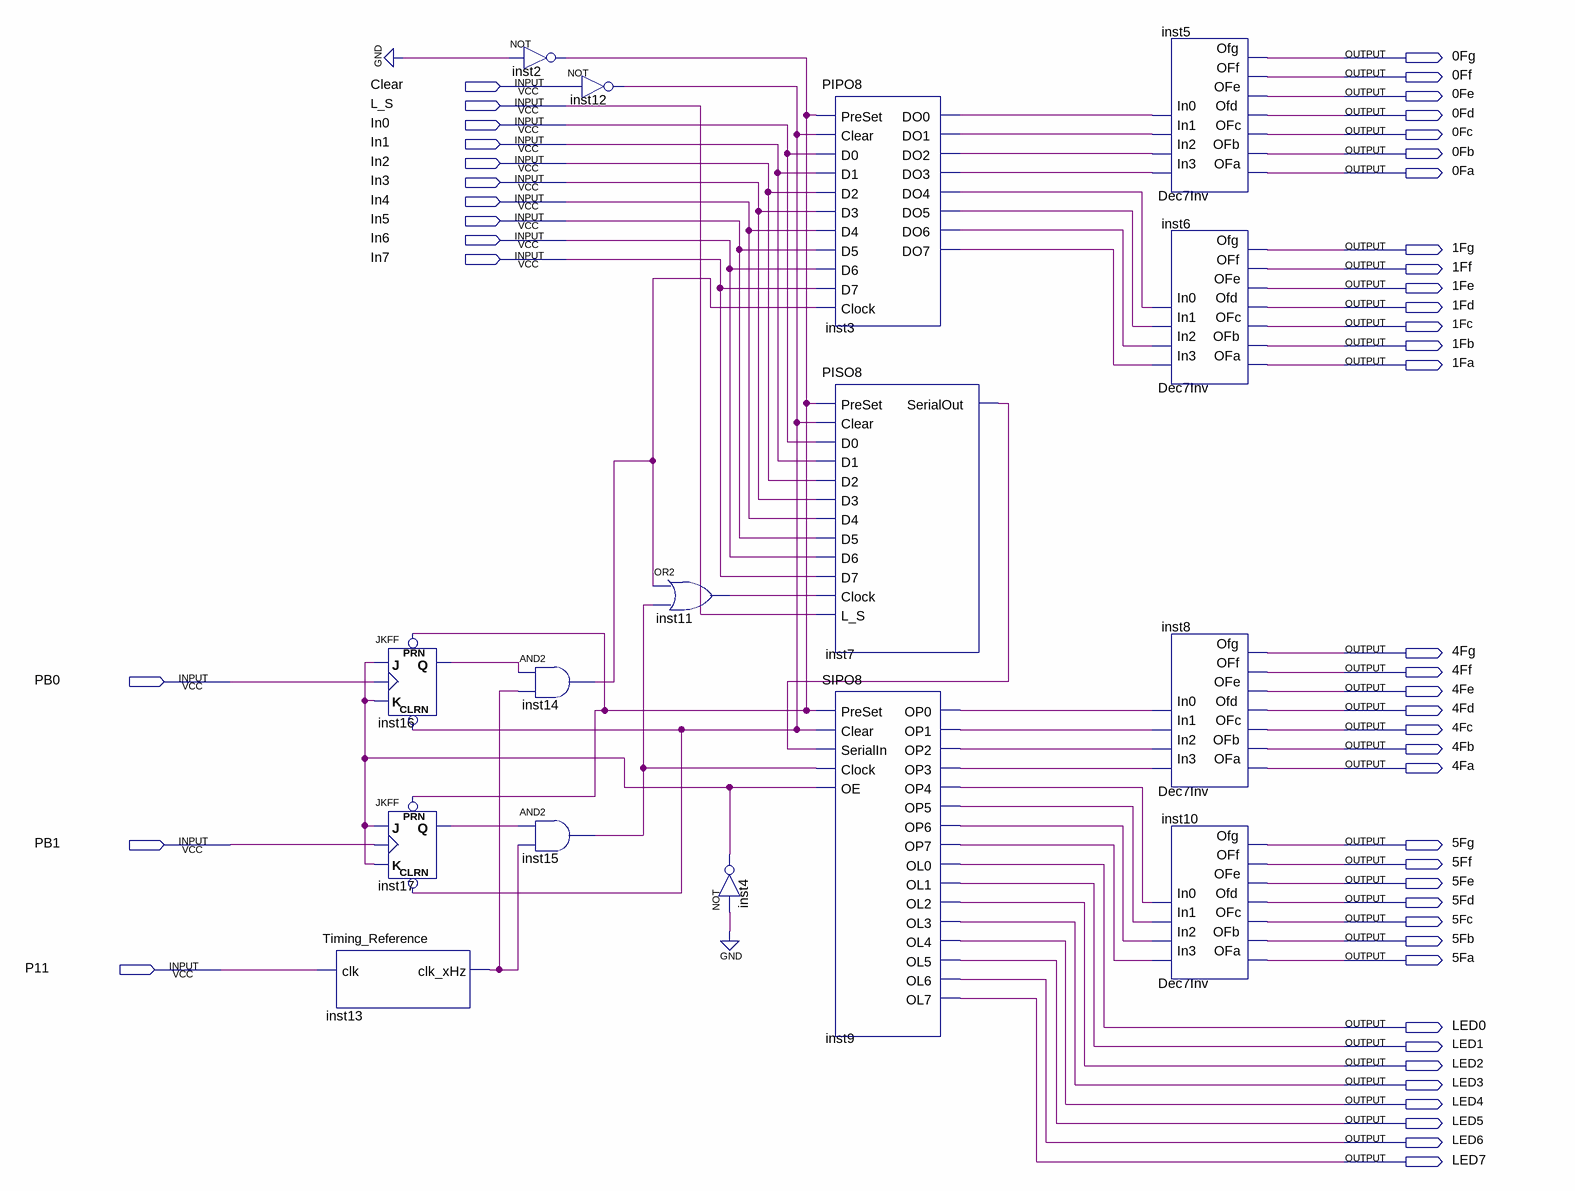
[diagram p0: schematic sheet]
// Quartus schematic Lab3.bdf as structural Verilog: 16 symbols, 49 pins
module Lab3 (
  input  Clear,
  input  L_S,
  input  In0,
  input  In1,
  input  In2,
  input  In3,
  input  In4,
  input  In5,
  input  In6,
  input  In7,
  input  PB0,
  input  PB1,
  input  P11,
  output \0Fg ,
  output \0Ff ,
  output \0Fe ,
  output \0Fd ,
  output \0Fc ,
  output \0Fb ,
  output \0Fa ,
  output \1Fg ,
  output \1Ff ,
  output \1Fe ,
  output \1Fd ,
  output \1Fc ,
  output \1Fb ,
  output \1Fa ,
  output \4Fg ,
  output \4Ff ,
  output \4Fe ,
  output \4Fd ,
  output \4Fc ,
  output \4Fb ,
  output \4Fa ,
  output \5Fg ,
  output \5Ff ,
  output \5Fe ,
  output \5Fd ,
  output \5Fc ,
  output \5Fb ,
  output \5Fa ,
  output LED0,
  output LED1,
  output LED2,
  output LED3,
  output LED4,
  output LED5,
  output LED6,
  output LED7
);

  wire inst2_out, inst3_do0, inst3_do1, inst3_do2, inst3_do3, inst3_do4, inst3_do5, inst3_do6, inst3_do7,
       inst4_out, inst7_serialout, inst9_op0, inst9_op1, inst9_op2, inst9_op3, inst9_op4, inst9_op5,
       inst9_op6, inst9_op7, inst11_out, inst12_out, inst13_clk_xhz, inst14_out, inst15_out, inst16_q,
       inst17_q;

  Timing_Reference inst13 (.clk(P11), .clk_xHz(inst13_clk_xhz));
  JKFF inst16 (.PRN(inst2_out), .CLRN(inst12_out), .K(inst4_out), .J(inst4_out), .CLK(PB0), .Q(inst16_q));
  JKFF inst17 (.PRN(inst2_out), .CLRN(inst12_out), .K(inst4_out), .J(inst4_out), .CLK(PB1), .Q(inst17_q));
  not inst2 (inst2_out, 1'b0);
  not inst12 (inst12_out, Clear);
  and inst14 (inst14_out, inst16_q, inst13_clk_xhz);
  and inst15 (inst15_out, inst17_q, inst13_clk_xhz);
  or inst11 (inst11_out, inst14_out, inst15_out);
  not inst4 (inst4_out, 1'b0);
  PIPO8 inst3 (
    .PreSet(inst2_out), .Clear(inst12_out), .D0(In0), .D1(In1), .D2(In2), .D3(In3), .D4(In4), .D5(In5),
    .D6(In6), .D7(In7), .Clock(inst14_out), .DO0(inst3_do0), .DO1(inst3_do1), .DO2(inst3_do2),
    .DO3(inst3_do3), .DO4(inst3_do4), .DO5(inst3_do5), .DO6(inst3_do6), .DO7(inst3_do7));
  PISO8 inst7 (
    .PreSet(inst2_out), .Clear(inst12_out), .D0(In0), .D1(In1), .D2(In2), .D3(In3), .D4(In4), .D5(In5),
    .D6(In6), .D7(In7), .Clock(inst11_out), .L_S(L_S), .SerialOut(inst7_serialout));
  SIPO8 inst9 (
    .PreSet(inst2_out), .Clear(inst12_out), .SerialIn(inst7_serialout), .Clock(inst15_out), .OE(inst4_out),
    .OP0(inst9_op0), .OP1(inst9_op1), .OP2(inst9_op2), .OP3(inst9_op3), .OP4(inst9_op4), .OP5(inst9_op5),
    .OP6(inst9_op6), .OP7(inst9_op7), .OL0(LED0), .OL1(LED1), .OL2(LED2), .OL3(LED3), .OL4(LED4), .OL5(LED5),
    .OL6(LED6), .OL7(LED7));
  Dec7Inv inst5 (
    .In3(inst3_do3), .In2(inst3_do2), .In1(inst3_do1), .In0(inst3_do0), .OFa(\0Fa ), .OFb(\0Fb ),
    .OFc(\0Fc ), .Ofd(\0Fd ), .OFe(\0Fe ), .OFf(\0Ff ), .Ofg(\0Fg ));
  Dec7Inv inst6 (
    .In3(inst3_do7), .In2(inst3_do6), .In1(inst3_do5), .In0(inst3_do4), .OFa(\1Fa ), .OFb(\1Fb ),
    .OFc(\1Fc ), .Ofd(\1Fd ), .OFe(\1Fe ), .OFf(\1Ff ), .Ofg(\1Fg ));
  Dec7Inv inst8 (
    .In3(inst9_op3), .In2(inst9_op2), .In1(inst9_op1), .In0(inst9_op0), .OFa(\4Fa ), .OFb(\4Fb ),
    .OFc(\4Fc ), .Ofd(\4Fd ), .OFe(\4Fe ), .OFf(\4Ff ), .Ofg(\4Fg ));
  Dec7Inv inst10 (
    .In3(inst9_op7), .In2(inst9_op6), .In1(inst9_op5), .In0(inst9_op4), .OFa(\5Fa ), .OFb(\5Fb ),
    .OFc(\5Fc ), .Ofd(\5Fd ), .OFe(\5Fe ), .OFf(\5Ff ), .Ofg(\5Fg ));
endmodule
